# Altium schematic sheet schemat_blokowy.SchDoc: Block diagram
size A4
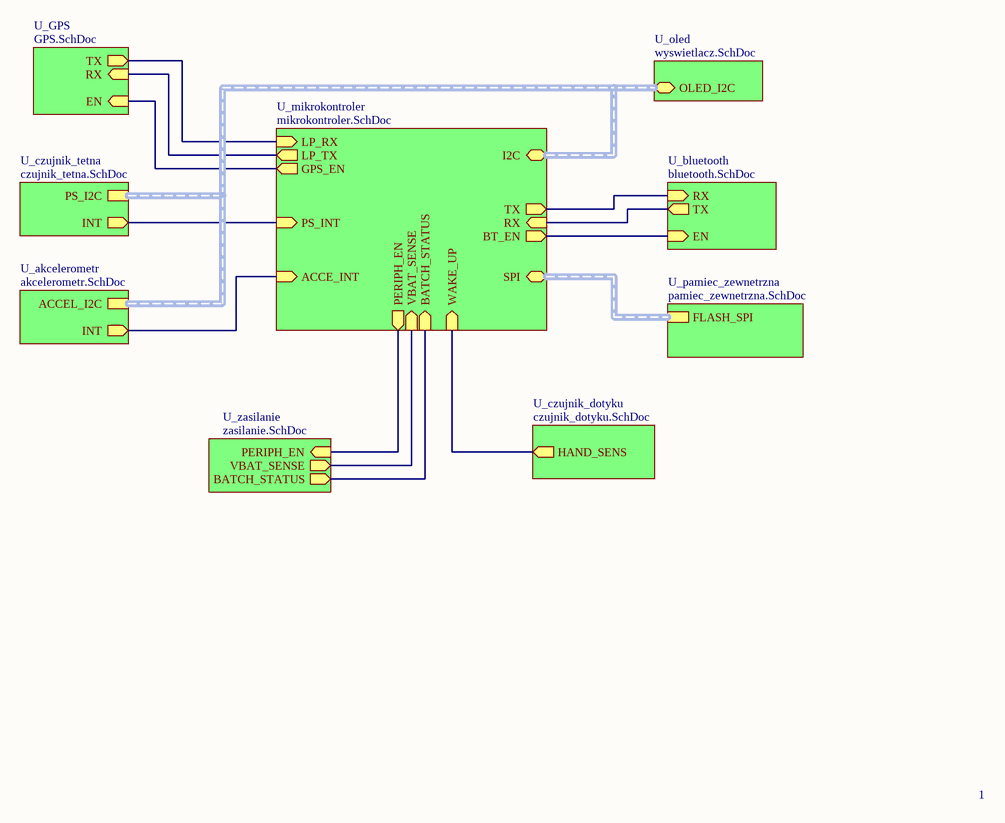
[diagram p0: schemat_blokowy.SchDoc]

## Sub-sheets
U_akcelerometr = akcelerometr.SchDoc: ACCEL_I2C (harness I2C), INT (out)
U_bluetooth = bluetooth.SchDoc: TX (out), RX (in), EN (in)
U_czujnik_dotyku = czujnik_dotyku.SchDoc: HAND_SENS (out)
U_czujnik_tetna = czujnik_tetna.SchDoc: PS_I2C (harness I2C), INT (out)
U_GPS = GPS.SchDoc: RX (in), TX (out), EN (in)
U_mikrokontroler = mikrokontroler.SchDoc: SPI (harness SPI), I2C (harness I2C), ACCE_INT (in), WAKE_UP (in), LP_TX (out), LP_RX (in), TX (out), RX (in), PS_INT (in), BT_EN (out), GPS_EN (out), PERIPH_EN (out), VBAT_SENSE (in), BATCH_STATUS (in)
U_oled = wyswietlacz.SchDoc: OLED_I2C (harness I2C)
U_pamiec_zewnetrzna = pamiec_zewnetrzna.SchDoc: FLASH_SPI (harness SPI)
U_zasilanie = zasilanie.SchDoc: PERIPH_EN (in), VBAT_SENSE (out), BATCH_STATUS (out)

## Nets
(unnamed): sheet U_bluetooth/TX, sheet U_mikrokontroler/RX
(unnamed): sheet U_bluetooth/RX, sheet U_mikrokontroler/TX
(unnamed): sheet U_bluetooth/EN, sheet U_mikrokontroler/BT_EN
(unnamed): sheet U_czujnik_tetna/INT, sheet U_mikrokontroler/PS_INT
(unnamed): sheet U_akcelerometr/INT, sheet U_mikrokontroler/ACCE_INT
(unnamed): sheet U_czujnik_dotyku/HAND_SENS, sheet U_mikrokontroler/WAKE_UP
(unnamed): sheet U_zasilanie/PERIPH_EN, sheet U_mikrokontroler/PERIPH_EN
(unnamed): sheet U_zasilanie/VBAT_SENSE, sheet U_mikrokontroler/VBAT_SENSE
(unnamed): sheet U_zasilanie/BATCH_STATUS, sheet U_mikrokontroler/BATCH_STATUS
(unnamed): sheet U_mikrokontroler/LP_TX, sheet U_GPS/RX
(unnamed): sheet U_mikrokontroler/LP_RX, sheet U_GPS/TX
(unnamed): sheet U_mikrokontroler/GPS_EN, sheet U_GPS/EN

## Buses and harness runs
harness sheet U_akcelerometr/ACCEL_I2C = sheet U_czujnik_tetna/PS_I2C = sheet U_mikrokontroler/I2C = sheet U_oled/OLED_I2C
harness sheet U_mikrokontroler/SPI = sheet U_pamiec_zewnetrzna/FLASH_SPI

## Notes on the sheet
- 1